# EAGLE design Miranda McMickens_Final Light (EAGLE 9.2.2)
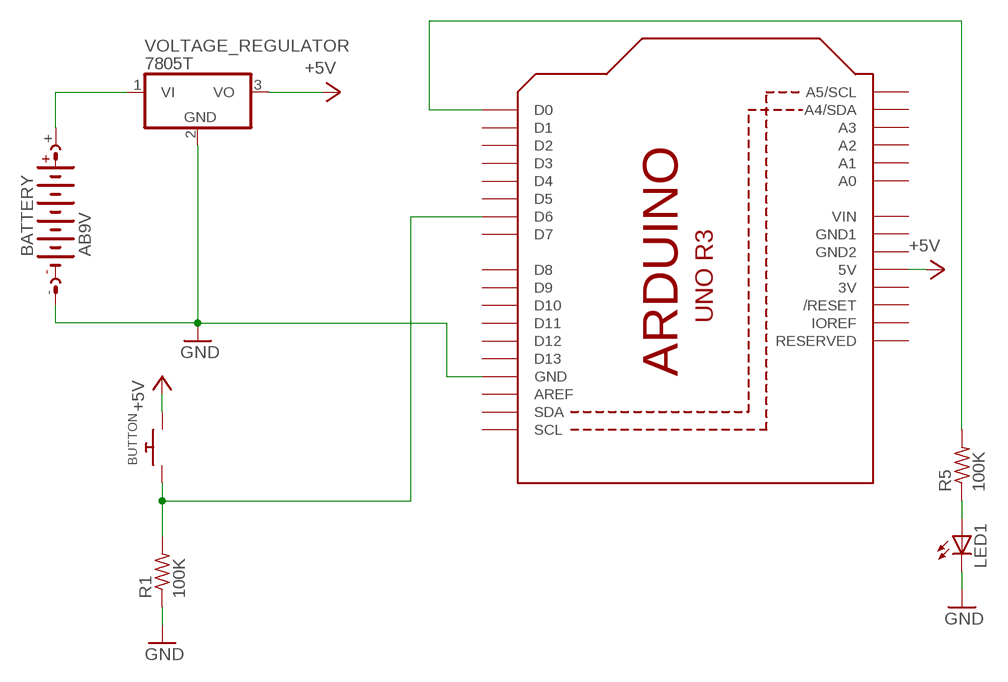
[diagram p0: schematic, sheet 1]

## Parts
BATTERY  AB9V  [AB9V]
BUTTON  SWITCH_PUSHBUTTONSOFTTOUCHSMD_SJ  [PUSHBUTTON_SMD_SJ]
LED1  LED5MM  [LED5MM]
R1  100K  R-US_M0805  [M0805]
R5  100K  R-US_M0805  [M0805]
U1  ARDUINOR3-BPLACE  [ARDUINOR3-BPLACE]
VOLTAGE_REGULATOR  7805T  [TO220H]

## Nets
+5V: BUTTON.P$2 U1.5V VOLTAGE_REGULATOR.3(VO)
GND: BATTERY.- LED1.K(C) R1.1 U1.GND VOLTAGE_REGULATOR.2(GND)
N$1: BATTERY.+ VOLTAGE_REGULATOR.1(VI)
N$5: BUTTON.P$1 R1.2 U1.D6
N$8: R5.2 U1.D0
N$9: LED1.A R5.1
Unconnected: U1.A0 U1.A1 U1.A2 U1.A3 U1.A4(A4/SDA) U1.A5(A5/SCL) U1.AREF U1.D1 U1.D2 U1.D3 U1.D4 U1.D5 U1.D7 U1.D8 U1.D9 U1.D10 U1.D11 U1.D12 U1.D13 U1.IOREF U1.RESERVED U1.RESET(/RESET) U1.SCL U1.SDA

## Power pins joined to a net without a drawn wire
3V: U1.3V
GND1: U1.GND1
GND2: U1.GND2
VIN: U1.VIN

## Library data of the parts
BATTERY = battery:AB9V: 9-V BATTERY CLIP
BUTTON = adafruit:SWITCH_PUSHBUTTON: Buttons SOFTTOUCHSMD_SJ - Soft touch temporary push button (Super Junk Akihabara) Compatible with SKPMANE010 [Mouser: 688-SKPMAN] C&K_KSS = Digikey: KSS221GLFS
LED1 = adafruit:LED: LED OSRAM: - CHIPLED LG R971, LG N971, LY N971, LG Q971, LY Q971, LO R971, LY R971 LH N974, LH R974 LS Q976, LO Q976, LY Q976 LO Q996 - Hyper CHIPLED LW Q18S LB Q993, LB Q99A, LB R99A - SideLED LS A670, LO A670, LY A670, LG A670, LP A670 LB A673, LV A673, LT A673, LW A673 LH A674 LY A675 LS A676, LA A676, LO A676, LY A676, LW A676 LS A679, LY A679, LG A679 - Hyper Micro SIDELED® LS Y876, LA Y876, LO Y876, LY Y876 LT Y87S - SmartLED LW L88C, LW L88S LB L89C, LB L89S, LG L890 LS L89K, LO L89K, LY L89K LS L896, LA L896, LO L896, LY L896 - TOPLED LS T670, LO T670, LY T670, LG T670, LP T670 LSG T670, LSP T670, LSY T670, LOP T670, LYG T670 LG T671, LOG T671, LSG T671 LB T673, LV T673, LT T673, LW T673 LH T674 LS T676, LA T676, LO T676, LY T676, LB T676, LH T676, LSB T676, LW T676 LB T67C, LV T67C, LT T67C, LS T67K, LO T67K, LY T67K, LW E67C LS E67B, LA E67B, LO E67B, LY E67B, LB E67C, LV E67C, LT E67C LW T67C LS T679, LY T679, LG T679 LS T770, LO T770, LY T770, LG T770, LP T770 LB T773, LV T773, LT T773, LW T773 LH T774 LS E675, LA E675, LY E675, LS T675 LS T776, LA T776, LO T776, LY T776, LB T776 LHGB T686 LT T68C, LB T68C - Hyper Mini TOPLED® LB M676 - Mini TOPLED Santana® LG M470 LS M47K, LO M47K, LY M47K Source: http://www.osram.convergy.de/
R1 R5 = adafruit:R-US_: RESISTOR, American symbol
U1 = adafruit:ARDUINOR3: This is a new object for the new Arduino R3 - with extra pins that you may want to use (such as IOref, and duplicated A4/A5
VOLTAGE_REGULATOR = adafruit:78*: Positive VOLTAGE REGULATOR Added bigger pads to the TO-92 package

## Board
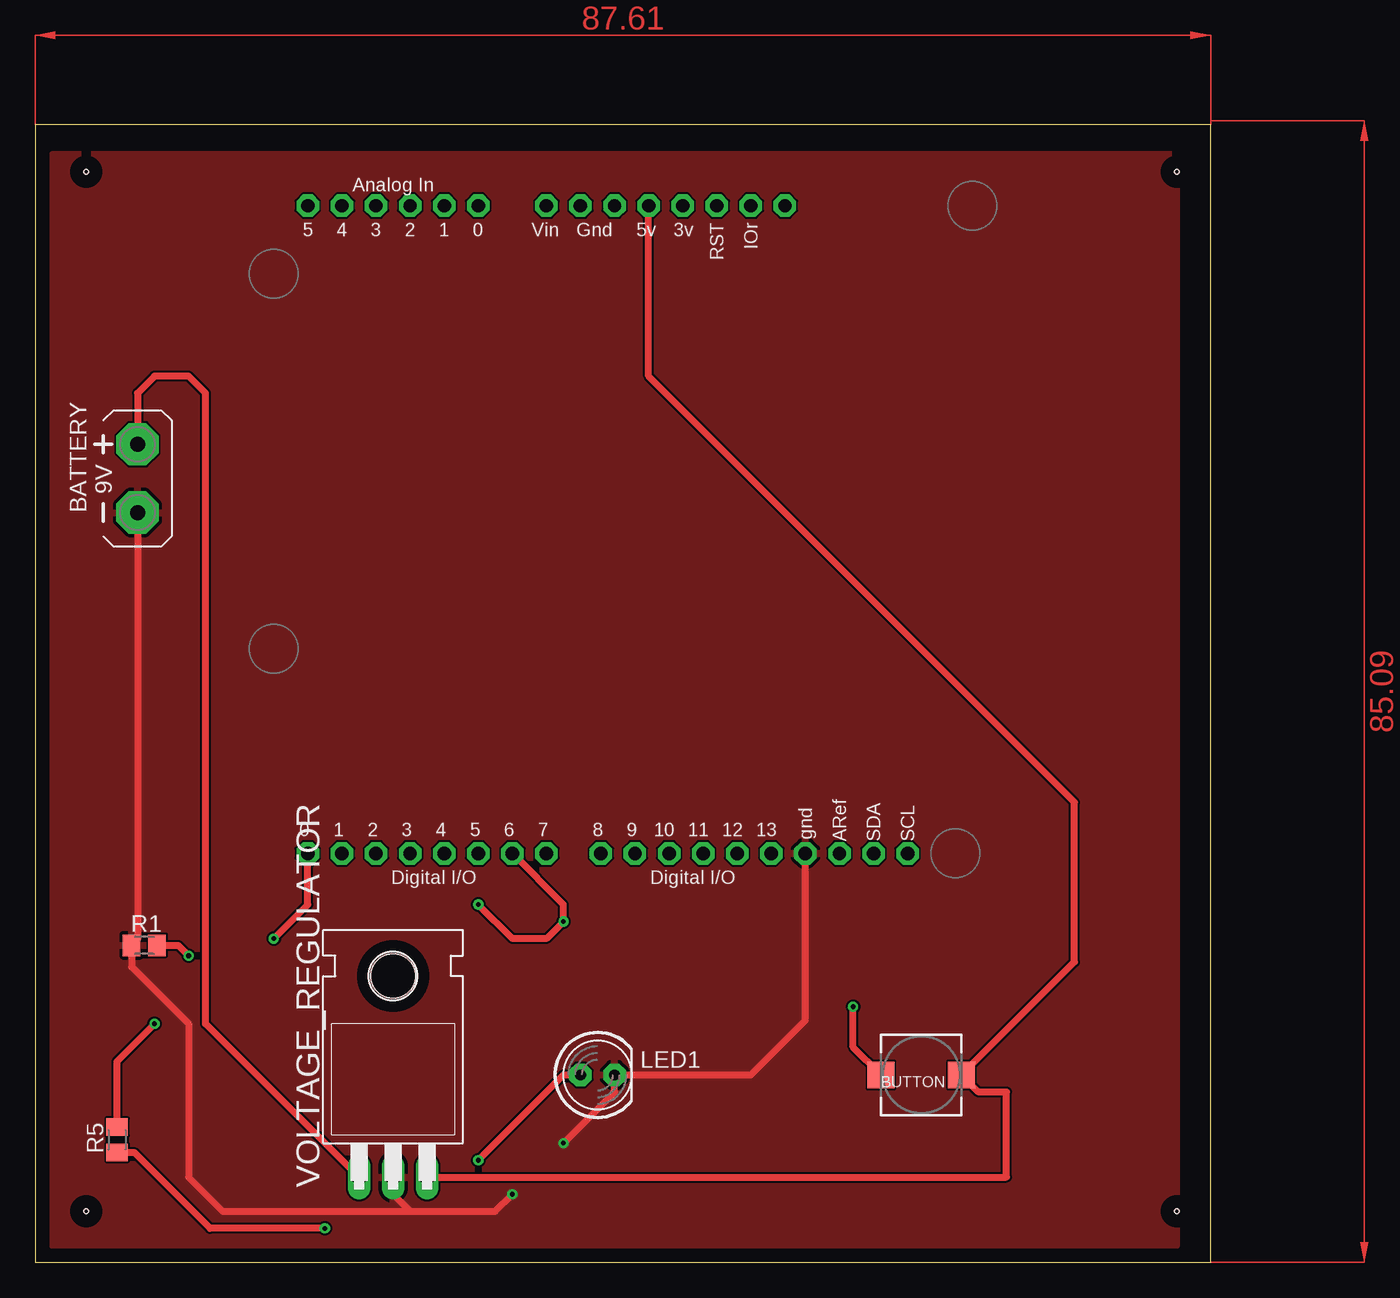
[diagram p1: board, top side]
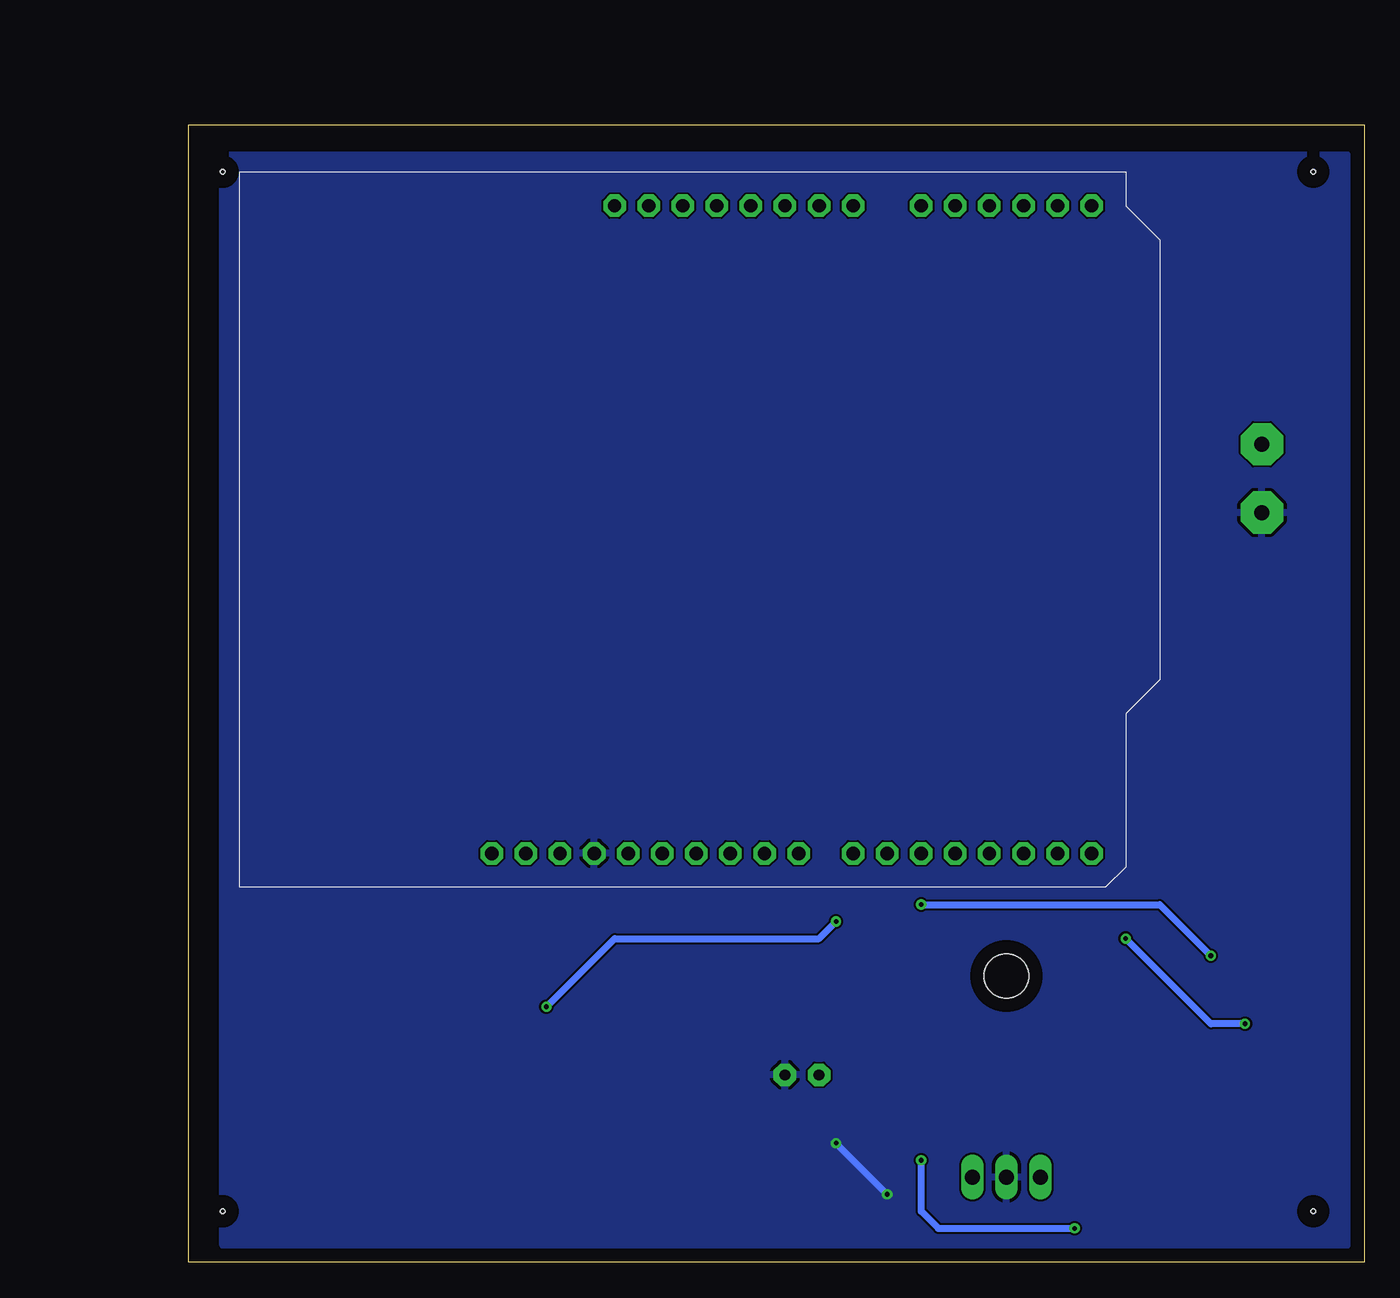
[diagram p2: board, bottom side, seen from below]

Size 87.61 x 84.76 mm. Coordinates in mm from the lower left corner, seen from the top.
Outline: 0,0 87.61,0 87.61,84.76 0,84.76 0,0
Copper layers (1*16): Top 0.035mm / dielectric 1.5mm / Bottom 0.035mm
Design rules "default": minimum track width 6mil, minimum drill 0.35mm, track to track 6mil, track to pad 6mil, pad to pad 6mil, via to via 6mil, smd to smd 6mil, copper to edge 40mil, drill to drill 6mil, minimum pad ring 10mil, minimum via ring 8mil, stop-mask expansion 4mil, vias tented up to drill 0mil, thermal gap 10mil
Holes 0.35 mm at 3.81,81.28 85.09,3.81 3.81,3.81 85.09,81.28

### Footprints (pad centres in the part's own frame; a part is rotated, then mirrored left to right if it is on the bottom)
AB9V = drill 1.118 pad 3.15 octagon: + 0,2.54; - 0,-2.54
PUSHBUTTON_SMD_SJ = smd 2 x 2: P$1 3,0; P$2 -3,0
LED5MM = drill 0.813 pad 1.676 octagon: A -1.27,0; K 1.27,0
M0805 = smd 1.3 x 1.6: 1 -0.95,0; 2 0.95,0
ARDUINOR3-BPLACE = drill 1 pad 1.676 octagon: 3V 35.56,2.54; 5V 38.1,2.54; A0 50.8,2.54; A1 53.34,2.54; A2 55.88,2.54; A3 58.42,2.54; A4 60.96,2.54; A5 63.5,2.54; AREF 23.876,50.8; D0 63.5,50.8; D1 60.96,50.8; D2 58.42,50.8; D3 55.88,50.8; D4 53.34,50.8; D5 50.8,50.8; D6 48.26,50.8; D7 45.72,50.8; D8 41.656,50.8; D9 39.116,50.8; D10 36.576,50.8; D11 34.036,50.8; D12 31.496,50.8; D13 28.956,50.8; GND 26.416,50.8; GND1 43.18,2.54; GND2 40.64,2.54; IOREF 30.48,2.54; RESERVED 27.94,2.54; RESET 33.02,2.54; SCL 18.796,50.8; SDA 21.336,50.8; VIN 45.72,2.54
TO220H = drill 1.118 long: 1 -2.54,-10.16; 2 0,-10.16; 3 2.54,-10.16 | hole 3.302: 0,4.826

### Placement (x,y rotation side)
BATTERY  7.62,58.42 0 top
BUTTON  66.04,13.97 180 top
LED1  41.91,13.97 0 top
R1  8.13,23.62 0 top
R5  6.1,9.14 90 top
U1  83.82,81.28 180 top
VOLTAGE_REGULATOR  26.67,16.51 0 top

### Tracks (layer width: path | path; a pad name or v marks a point on that pad's centre or on a via)
+5V
  Top 0.508: VOLTAGE_REGULATOR.3 72.39,6.35 72.39,12.7 70.31,12.7 BUTTON.P$2 77.47,22.4 77.47,34.29 45.72,66.04 U1.5V
GND  (via drill 0.35)
  Top 0.508: U1.GND 57.4,18.03 53.34,13.97 LED1.K 43.18,12.7 v39.37,8.89 | BATTERY.- 7.62,24.06 R1.1 7.18,22.03 11.43,17.78 11.43,6.35 13.97,3.81 27.94,3.81 | VOLTAGE_REGULATOR.2 26.67,5.08 27.94,3.81 | 27.94,3.81 34.29,3.81 v35.56,5.08
  Bottom 0.508: v35.56,5.08 v39.37,8.89
  pour Top: 1.27,82.55 1.27,1.27 85.09,1.27 85.09,82.55
  pour Bottom: 1.27,82.55 1.27,1.27 85.09,1.27 85.09,82.55
N$1
  Top 0.508: VOLTAGE_REGULATOR.1 12.7,17.78 12.7,64.77 11.43,66.04 8.89,66.04 7.62,64.77 BATTERY.+
N$5  (via drill 0.35)
  Top 0.508: BUTTON.P$1 60.96,16.05 v60.96,19.05 | U1.D6 39.37,26.67 v39.37,25.4 38.1,24.13 35.56,24.13 v33.02,26.67 | R1.2 10.67,23.62 v11.43,22.86
  Bottom 0.508: v60.96,19.05 55.88,24.13 40.64,24.13 v39.37,25.4 | v11.43,22.86 15.24,26.67 v33.02,26.67
N$8  (via drill 0.35)
  Top 0.508: R5.2 6.1,14.99 v8.89,17.78 | v17.78,24.13 20.32,26.67 U1.D0
  Bottom 0.508: v8.89,17.78 11.43,17.78 v17.78,24.13
N$9  (via drill 0.35)
  Top 0.508: R5.1 7.37,8.19 13.02,2.54 v21.59,2.54 | v33.02,7.62 39.37,13.97 LED1.A
  Bottom 0.508: v21.59,2.54 31.75,2.54 33.02,3.81 v33.02,7.62
(copper drawn outside any net)
  shapes: Top area x2